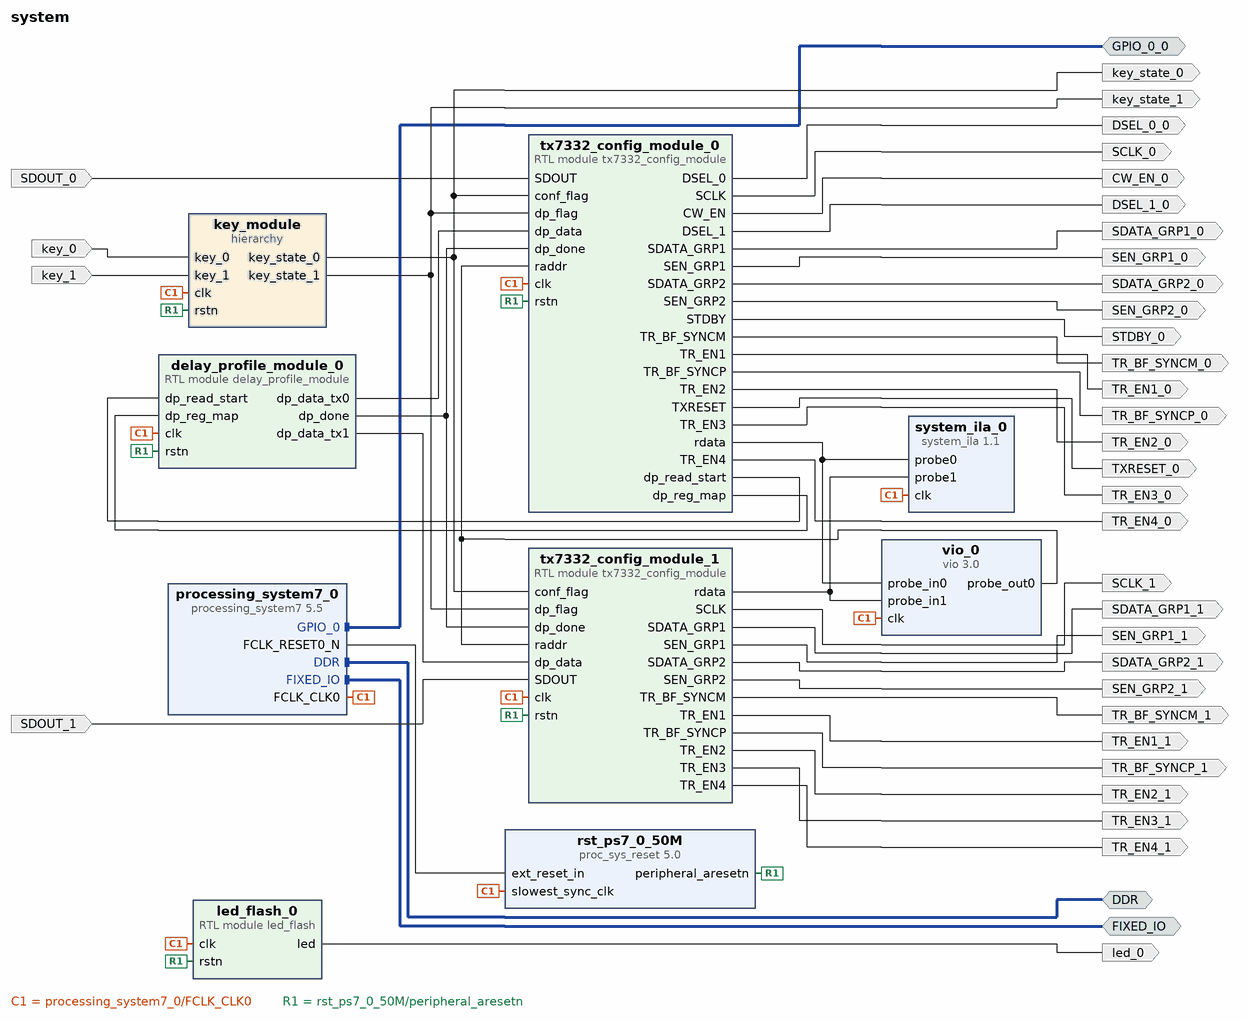
[diagram p0: block diagram of the top level]
# Vivado block design system, xc7z030sbg485-2, Vivado 2020.2
create_bd_design system

create_bd_intf_port -mode Master -vlnv xilinx.com:interface:ddrx_rtl:1.0 DDR
create_bd_intf_port -mode Master -vlnv xilinx.com:display_processing_system7:fixedio_rtl:1.0 FIXED_IO
create_bd_intf_port -mode Master -vlnv xilinx.com:interface:gpio_rtl:1.0 GPIO_0_0
create_bd_port -dir I key_0
create_bd_port -dir O key_state_0
create_bd_port -dir O SCLK_0
create_bd_port -dir O SDATA_GRP1_0
create_bd_port -dir O SDATA_GRP2_0
create_bd_port -dir I SDOUT_0
create_bd_port -dir O SEN_GRP1_0
create_bd_port -dir O SEN_GRP2_0
create_bd_port -dir O TXRESET_0
create_bd_port -dir O DSEL_0_0
create_bd_port -dir O DSEL_1_0
create_bd_port -dir O STDBY_0
create_bd_port -dir O CW_EN_0
create_bd_port -dir O TR_EN1_0
create_bd_port -dir O TR_EN2_0
create_bd_port -dir O TR_EN3_0
create_bd_port -dir O TR_EN4_0
create_bd_port -dir I SDOUT_1
create_bd_port -dir O SCLK_1
create_bd_port -dir O SEN_GRP1_1
create_bd_port -dir O SEN_GRP2_1
create_bd_port -dir O SDATA_GRP1_1
create_bd_port -dir O SDATA_GRP2_1
create_bd_port -dir O TR_EN1_1
create_bd_port -dir O TR_EN2_1
create_bd_port -dir O TR_EN3_1
create_bd_port -dir O TR_EN4_1
create_bd_port -dir I key_1
create_bd_port -dir O key_state_1
create_bd_port -dir O led_0
create_bd_port -dir O TR_BF_SYNCP_0
create_bd_port -dir O TR_BF_SYNCM_0
create_bd_port -dir O TR_BF_SYNCP_1
create_bd_port -dir O TR_BF_SYNCM_1

create_bd_cell -type ip -vlnv xilinx.com:ip:processing_system7:5.5 processing_system7_0
set_property -dict [list \
  CONFIG.PCW_FPGA0_PERIPHERAL_FREQMHZ 200 \
  CONFIG.PCW_FPGA1_PERIPHERAL_FREQMHZ 20 \
  CONFIG.PCW_GPIO_EMIO_GPIO_ENABLE 1 \
  CONFIG.PCW_GPIO_EMIO_GPIO_IO 1 \
  CONFIG.PCW_GPIO_EMIO_GPIO_WIDTH 1 \
  CONFIG.PCW_GPIO_MIO_GPIO_ENABLE 1 \
  CONFIG.PCW_GPIO_MIO_GPIO_IO MIO \
  CONFIG.PCW_I2C0_GRP_INT_ENABLE 0 \
  CONFIG.PCW_I2C0_I2C0_IO {MIO 18 .. 19} \
  CONFIG.PCW_I2C0_PERIPHERAL_ENABLE 1 \
  CONFIG.PCW_I2C1_I2C1_IO {MIO 20 .. 21} \
  CONFIG.PCW_I2C1_PERIPHERAL_ENABLE 1 \
  CONFIG.PCW_I2C_PERIPHERAL_FREQMHZ 111.111115 \
  CONFIG.PCW_I2C_RESET_ENABLE 1 \
  CONFIG.PCW_I2C_RESET_SELECT {Share reset pin} \
  CONFIG.PCW_SPI1_PERIPHERAL_ENABLE 1 \
  CONFIG.PCW_SPI1_SPI1_IO {MIO 22 .. 27} \
  CONFIG.PCW_UART1_PERIPHERAL_ENABLE 1 \
  CONFIG.PCW_UART1_UART1_IO {MIO 16 .. 17} \
  CONFIG.PCW_UART_PERIPHERAL_FREQMHZ 100 \
  CONFIG.PCW_UIPARAM_DDR_PARTNO {MT41J256M16 RE-125} \
  CONFIG.PCW_USB_RESET_ENABLE 1 \
  CONFIG.PCW_USE_M_AXI_GP0 0 \
] [get_bd_cells processing_system7_0]
# 205 more settings of processing_system7_0 are not shown: defaults, MIO pin electricals, DDR timing, and values the tool derives
create_bd_cell -type ip -vlnv xilinx.com:ip:proc_sys_reset:5.0 rst_ps7_0_50M
create_bd_cell -type hier key_module
create_bd_cell -type ip -vlnv xilinx.com:ip:system_ila:1.1 system_ila_0
set_property -dict [list \
  CONFIG.C_DATA_DEPTH 4096 \
  CONFIG.C_MON_TYPE NATIVE \
  CONFIG.C_NUM_OF_PROBES 4 \
  CONFIG.C_PROBE0_TYPE 0 \
  CONFIG.C_PROBE_WIDTH_PROPAGATION AUTO \
] [get_bd_cells system_ila_0]
create_bd_cell -type module -reference led_flash led_flash_0
create_bd_cell -type ip -vlnv xilinx.com:ip:vio:3.0 vio_0
set_property -dict {CONFIG.C_NUM_PROBE_IN 2 CONFIG.C_PROBE_OUT0_INIT_VAL 0x015 CONFIG.C_PROBE_OUT0_WIDTH 10} [get_bd_cells vio_0]
create_bd_cell -type module -reference delay_profile_module delay_profile_module_0
create_bd_cell -type module -reference tx7332_config_module tx7332_config_module_0
create_bd_cell -type module -reference tx7332_config_module tx7332_config_module_1

# ---- hierarchy /key_module ----
current_bd_instance /key_module
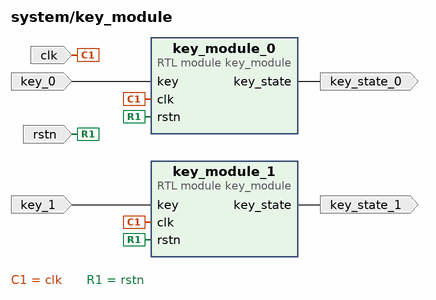
[diagram p1: block diagram inside /key_module]
create_bd_pin -dir I -type clk clk
create_bd_pin -dir I -type rst rstn
create_bd_pin -dir I key_0
create_bd_pin -dir O key_state_0
create_bd_pin -dir I key_1
create_bd_pin -dir O key_state_1

create_bd_cell -type module -reference key_module key_module_0
create_bd_cell -type module -reference key_module key_module_1

# ---- connections ----

current_bd_instance /key_module
connect_bd_net -net processing_system7_0_FCLK_CLK0 [get_bd_pins clk] [get_bd_pins key_module_0/clk] [get_bd_pins key_module_1/clk]
connect_bd_net -net rst_ps7_0_50M_peripheral_aresetn [get_bd_pins rstn] [get_bd_pins key_module_0/rstn] [get_bd_pins key_module_1/rstn]
connect_bd_net -net key_0_1 [get_bd_pins key_0] [get_bd_pins key_module_0/key]
connect_bd_net [get_bd_pins key_module_0/key_state] [get_bd_pins key_state_0]
connect_bd_net -net key_1_1 [get_bd_pins key_1] [get_bd_pins key_module_1/key]
connect_bd_net [get_bd_pins key_module_1/key_state] [get_bd_pins key_state_1]

current_bd_instance /
connect_bd_intf_net [get_bd_intf_ports GPIO_0_0] [get_bd_intf_pins processing_system7_0/GPIO_0]
connect_bd_intf_net [get_bd_intf_ports DDR] [get_bd_intf_pins processing_system7_0/DDR]
connect_bd_intf_net [get_bd_intf_ports FIXED_IO] [get_bd_intf_pins processing_system7_0/FIXED_IO]
connect_bd_net [get_bd_pins processing_system7_0/FCLK_CLK0] \
  [get_bd_pins rst_ps7_0_50M/slowest_sync_clk] [get_bd_pins key_module/clk] [get_bd_pins system_ila_0/clk] \
  [get_bd_pins led_flash_0/clk] [get_bd_pins vio_0/clk] [get_bd_pins delay_profile_module_0/clk] \
  [get_bd_pins tx7332_config_module_0/clk] [get_bd_pins tx7332_config_module_1/clk]
connect_bd_net [get_bd_pins processing_system7_0/FCLK_RESET0_N] [get_bd_pins rst_ps7_0_50M/ext_reset_in]
connect_bd_net [get_bd_pins rst_ps7_0_50M/peripheral_aresetn] \
  [get_bd_pins key_module/rstn] [get_bd_pins led_flash_0/rstn] [get_bd_pins delay_profile_module_0/rstn] \
  [get_bd_pins tx7332_config_module_0/rstn] [get_bd_pins tx7332_config_module_1/rstn]
connect_bd_net -net key_0_1 [get_bd_ports key_0] [get_bd_pins key_module/key_0]
connect_bd_net -net key_module_0_key_state [get_bd_pins key_module/key_state_0] \
  [get_bd_ports key_state_0] [get_bd_pins tx7332_config_module_0/conf_flag] [get_bd_pins tx7332_config_module_1/conf_flag]
connect_bd_net [get_bd_pins tx7332_config_module_0/SCLK] [get_bd_ports SCLK_0]
connect_bd_net [get_bd_pins tx7332_config_module_0/SEN_GRP1] [get_bd_ports SEN_GRP1_0]
connect_bd_net [get_bd_pins tx7332_config_module_0/SEN_GRP2] [get_bd_ports SEN_GRP2_0]
connect_bd_net [get_bd_pins tx7332_config_module_0/SDATA_GRP1] [get_bd_ports SDATA_GRP1_0]
connect_bd_net [get_bd_pins tx7332_config_module_0/SDATA_GRP2] [get_bd_ports SDATA_GRP2_0]
connect_bd_net -net SDOUT_0_1 [get_bd_ports SDOUT_0] [get_bd_pins tx7332_config_module_0/SDOUT]
connect_bd_net [get_bd_pins tx7332_config_module_0/TXRESET] [get_bd_ports TXRESET_0]
connect_bd_net [get_bd_pins tx7332_config_module_0/DSEL_0] [get_bd_ports DSEL_0_0]
connect_bd_net [get_bd_pins tx7332_config_module_0/DSEL_1] [get_bd_ports DSEL_1_0]
connect_bd_net [get_bd_pins tx7332_config_module_0/STDBY] [get_bd_ports STDBY_0]
connect_bd_net [get_bd_pins tx7332_config_module_0/CW_EN] [get_bd_ports CW_EN_0]
connect_bd_net [get_bd_pins tx7332_config_module_0/TR_EN1] [get_bd_ports TR_EN1_0]
connect_bd_net [get_bd_pins tx7332_config_module_0/TR_EN2] [get_bd_ports TR_EN2_0]
connect_bd_net [get_bd_pins tx7332_config_module_0/TR_EN3] [get_bd_ports TR_EN3_0]
connect_bd_net [get_bd_pins tx7332_config_module_0/TR_EN4] [get_bd_ports TR_EN4_0]
connect_bd_net -net SDOUT_1_1 [get_bd_ports SDOUT_1] [get_bd_pins tx7332_config_module_1/SDOUT]
connect_bd_net [get_bd_pins tx7332_config_module_1/SCLK] [get_bd_ports SCLK_1]
connect_bd_net [get_bd_pins tx7332_config_module_1/SEN_GRP1] [get_bd_ports SEN_GRP1_1]
connect_bd_net [get_bd_pins tx7332_config_module_1/SEN_GRP2] [get_bd_ports SEN_GRP2_1]
connect_bd_net [get_bd_pins tx7332_config_module_1/SDATA_GRP1] [get_bd_ports SDATA_GRP1_1]
connect_bd_net [get_bd_pins tx7332_config_module_1/SDATA_GRP2] [get_bd_ports SDATA_GRP2_1]
connect_bd_net [get_bd_pins tx7332_config_module_1/TR_EN1] [get_bd_ports TR_EN1_1]
connect_bd_net [get_bd_pins tx7332_config_module_1/TR_EN2] [get_bd_ports TR_EN2_1]
connect_bd_net [get_bd_pins tx7332_config_module_1/TR_EN3] [get_bd_ports TR_EN3_1]
connect_bd_net [get_bd_pins tx7332_config_module_1/TR_EN4] [get_bd_ports TR_EN4_1]
connect_bd_net -net key_1_1 [get_bd_ports key_1] [get_bd_pins key_module/key_1]
connect_bd_net -net key_module_1_key_state [get_bd_pins key_module/key_state_1] \
  [get_bd_ports key_state_1] [get_bd_pins tx7332_config_module_0/dp_flag] [get_bd_pins tx7332_config_module_1/dp_flag]
connect_bd_net [get_bd_pins delay_profile_module_0/dp_done] [get_bd_pins tx7332_config_module_0/dp_done] [get_bd_pins tx7332_config_module_1/dp_done]
connect_bd_net [get_bd_pins delay_profile_module_0/dp_data_tx1] [get_bd_pins tx7332_config_module_1/dp_data]
connect_bd_net [get_bd_pins tx7332_config_module_0/dp_read_start] [get_bd_pins delay_profile_module_0/dp_read_start]
connect_bd_net -net delay_profile_module_0_dp_data [get_bd_pins delay_profile_module_0/dp_data_tx0] [get_bd_pins tx7332_config_module_0/dp_data]
connect_bd_net [get_bd_pins tx7332_config_module_0/dp_reg_map] [get_bd_pins delay_profile_module_0/dp_reg_map]
connect_bd_net -net rdata [get_bd_pins tx7332_config_module_0/rdata] [get_bd_pins system_ila_0/probe0] [get_bd_pins vio_0/probe_in0]
connect_bd_net [get_bd_pins tx7332_config_module_1/rdata] [get_bd_pins system_ila_0/probe1] [get_bd_pins vio_0/probe_in1]
connect_bd_net [get_bd_pins led_flash_0/led] [get_bd_ports led_0]
connect_bd_net [get_bd_pins vio_0/probe_out0] [get_bd_pins tx7332_config_module_0/raddr] [get_bd_pins tx7332_config_module_1/raddr]
connect_bd_net [get_bd_pins tx7332_config_module_0/TR_BF_SYNCM] [get_bd_ports TR_BF_SYNCM_0]
connect_bd_net [get_bd_pins tx7332_config_module_1/TR_BF_SYNCM] [get_bd_ports TR_BF_SYNCM_1]
connect_bd_net [get_bd_pins tx7332_config_module_1/TR_BF_SYNCP] [get_bd_ports TR_BF_SYNCP_1]
connect_bd_net [get_bd_pins tx7332_config_module_0/TR_BF_SYNCP] [get_bd_ports TR_BF_SYNCP_0]
set_property HDL_ATTRIBUTE.DEBUG true [get_bd_nets rdata]
set_property HDL_ATTRIBUTE.MARK_DEBUG true [get_bd_nets rdata]

validate_bd_design
save_bd_design
